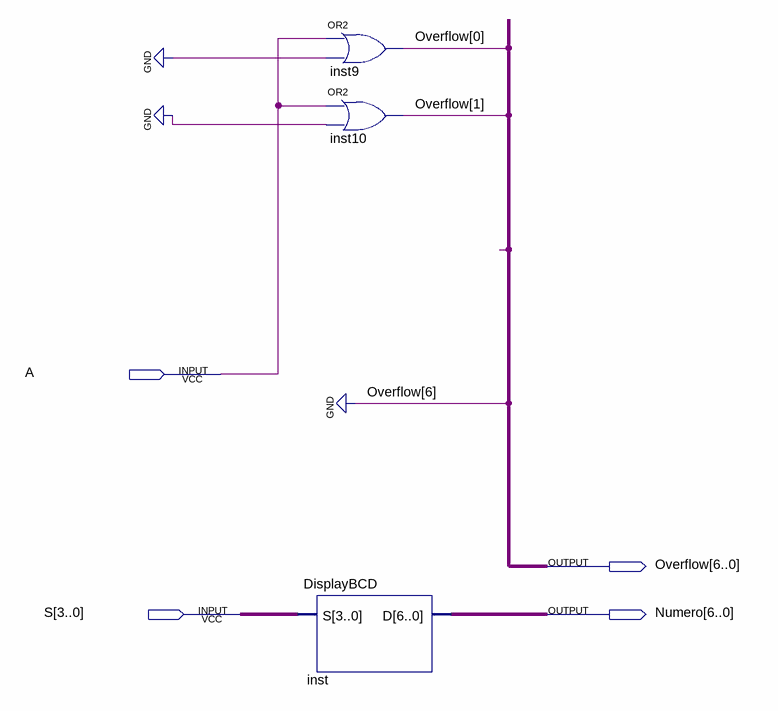
[diagram p0: schematic sheet]
// Quartus schematic DisplayBCDCOMPLETO.bdf as structural Verilog: 3 symbols, 4 pins
module DisplayBCDCOMPLETO (
  input  A,
  input  [3:0] S,
  output [6:0] Overflow,
  output [6:0] Numero
);

  or inst9 (Overflow[0], A, 1'b0);
  or inst10 (Overflow[1], A, 1'b0);
  DisplayBCD inst (.S(S), .D(Numero));

  assign Overflow[6] = 1'b0;
endmodule
